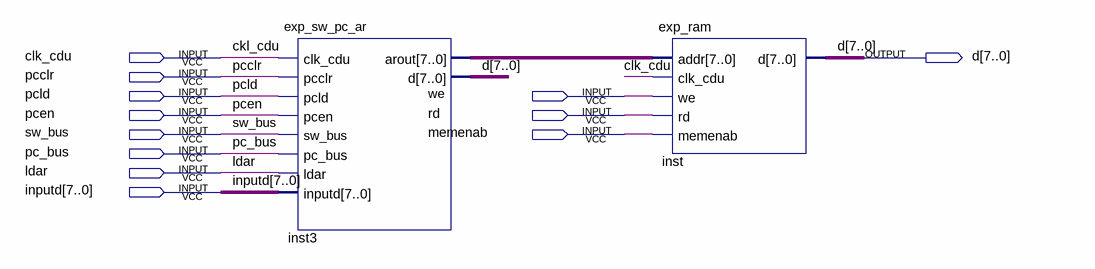
[diagram p0: schematic sheet]
// Quartus schematic pc_ram.bdf as structural Verilog: 2 symbols, 12 pins
module pc_ram (
  input  clk_cdu,
  input  pcclr,
  input  pcld,
  input  we,
  input  pcen,
  input  rd,
  input  sw_bus,
  input  memenab,
  input  pc_bus,
  input  ldar,
  input  [7:0] inputd,
  output [7:0] d
);

  wire [7:0] inst3_arout;

  exp_sw_pc_ar inst3 (
    .clk_cdu(clk_cdu), .pcclr(pcclr), .pcld(pcld), .pcen(pcen), .sw_bus(sw_bus), .pc_bus(pc_bus),
    .ldar(ldar), .inputd(inputd), .arout(inst3_arout), .d(d));
  exp_ram inst (.addr(inst3_arout), .clk_cdu(clk_cdu), .we(we), .rd(rd), .memenab(memenab), .d(d));

  // Other names for the same wires on the sheet: ckl_cdu = clk_cdu
endmodule
